# Altium schematic sheet CPU.SchDoc
size A4
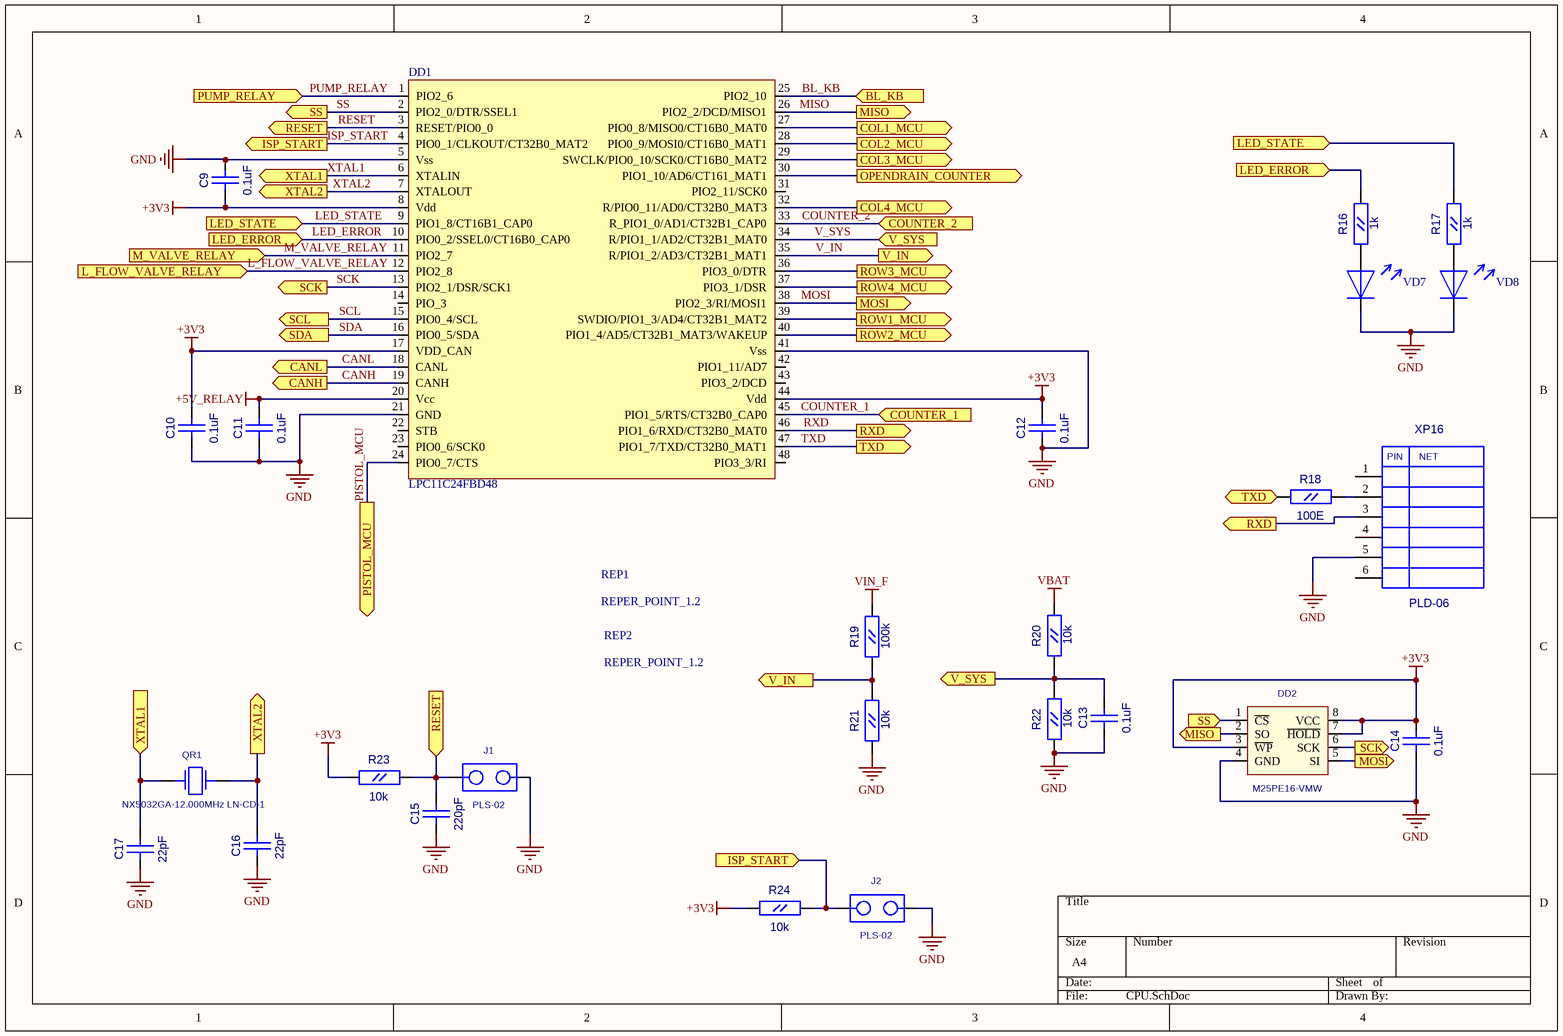
[diagram p0: CPU.SchDoc]

## Parts
C9  0.1uF  [CC0603]
C10  0.1uF  [CC0603]
C11  0.1uF  [CC0603]
C12  0.1uF  [CC0603]
C13  0.1uF  [CC0603]
C14  0.1uF  [CC0603]
C15  220pF  [CC0603]
C16  22pF  [CC0603]
C17  22pF  [CC0603]
DD1  LPC11C24FBD48  [LQFP-48]
DD2  M25PE16-VMW  [EIAJ_SO8]
J1  PLS-02  [PLS-02]
J2  PLS-02  [PLS-02]
QR1  NX5032GA-12.000MHz LN-CD-1  [AC5032_2]
R16  1k  [RC0603]
R17  1k  [RC0603]
R18  100E  [RC0603]
R19  100k  [RC0603]
R20  10k  [RC0603]
R21  10k  [RC0603]
R22  10k  [RC0603]
R23  10k  [RC0603]
R24  10k  [RC0603]
REP1  REPER_POINT_1.2  [REPER1.2]
REP2  REPER_POINT_1.2  [REPER1.2]
VD7  LED_0805  [LED0805]  (value not drawn)
VD8  LED_0805  [LED0805]  (value not drawn)
XP16  PLD-06  [PIN6]

## Ports
BL_KB (in), CANH (out), CANL (out), COL1_MCU (out), COL2_MCU (out), COL3_MCU (out), COL4_MCU (out), COUNTER_1 (in), COUNTER_2 (in), ISP_START (in), ISP_START (out), L_FLOW_VALVE_RELAY (in), LED_ERROR (in), LED_STATE (in), M_VALVE_RELAY (in), MISO, MISO (out), MOSI, MOSI (out), OPENDRAIN_COUNTER (out), PISTOL_MCU (out), PUMP_RELAY (in), RESET (in), RESET (out), ROW1_MCU (out), ROW2_MCU (out), ROW3_MCU (out), ROW4_MCU (out), RXD (out), SCK, SCK (out), SCL (out), SDA (out), SS (in), SS (out), TXD (in), TXD (out), V_IN (out), V_SYS (in), V_SYS (out), XTAL1 (in), XTAL1 (out), XTAL2 (out)

## Nets
+3V3: C9.1(A) C10.2(B) C12.2(B) C14.2(B) DD1.8(Vdd) DD1.17(VDD_CAN) DD1.44(Vdd) DD2.3(~{WP}) DD2.7(~{HOLD}) DD2.8(VCC) R23.1(A) R24.1(A)
+5V_RELAY: C11.2(B) DD1.20(Vcc)
GND: C9.2(B) C10.1(A) C11.1(A) C12.1(A) C13.1(A) C14.1(A) C15.1(A) C16.1(A) C17.1(A) DD1.5(Vss) DD1.21(GND) DD1.41(Vss) DD2.4(GND) J1.2 J2.2 R21.1(A) R22.1(A) VD7.2 VD8.2 XP16.5
VBAT: R20.2(B)
VIN_F: R19.2(B)
BL_KB: DD1.25(PIO2_10) ; port BL_KB
CANH: DD1.19(CANH) ; port CANH
CANL: DD1.18(CANL) ; port CANL
COL1_MCU: DD1.27(PIO0_8/MISO0/CT16B0_MAT0) ; port COL1_MCU
COL2_MCU: DD1.28(PIO0_9/MOSI0/CT16B0_MAT1) ; port COL2_MCU
COL3_MCU: DD1.29(SWCLK/PIO0_10/SCK0/CT16B0_MAT2) ; port COL3_MCU
COL4_MCU: DD1.32(R/PIO0_11/AD0/CT32B0_MAT3) ; port COL4_MCU
COUNTER_1: DD1.45(PIO1_5/RTS/CT32B0_CAP0) ; port COUNTER_1
COUNTER_2: DD1.33(R_PIO1_0/AD1/CT32B1_CAP0) ; port COUNTER_2
ISP_START: DD1.4(PIO0_1/CLKOUT/CT32B0_MAT2) J2.1 R24.2(B) ; port ISP_START
L_FLOW_VALVE_RELAY: DD1.12(PIO2_8) ; port L_FLOW_VALVE_RELAY
LED_ERROR: DD1.10(PIO0_2/SSEL0/CT16B0_CAP0) R16.2(B) ; port LED_ERROR
LED_STATE: DD1.9(PIO1_8/CT16B1_CAP0) R17.2(B) ; port LED_STATE
M_VALVE_RELAY: DD1.11(PIO2_7) ; port M_VALVE_RELAY
MISO: DD1.26(PIO2_2/DCD/MISO1) DD2.2(SO) ; port MISO
MOSI: DD1.38(PIO2_3/RI/MOSI1) DD2.5(SI) ; port MOSI
OPENDRAIN_COUNTER: DD1.30(PIO1_10/AD6/CT161_MAT1) ; port OPENDRAIN_COUNTER
PISTOL_MCU: DD1.24(PIO0_7/CTS) ; port PISTOL_MCU
PUMP_RELAY: DD1.1(PIO2_6) ; port PUMP_RELAY
RESET: C15.2(B) DD1.3(RESET/PIO0_0) J1.1 R23.2(B) ; port RESET
ROW1_MCU: DD1.39(SWDIO/PIO1_3/AD4/CT32B1_MAT2) ; port ROW1_MCU
ROW2_MCU: DD1.40(PIO1_4/AD5/CT32B1_MAT3/WAKEUP) ; port ROW2_MCU
ROW3_MCU: DD1.36(PIO3_0/DTR) ; port ROW3_MCU
ROW4_MCU: DD1.37(PIO3_1/DSR) ; port ROW4_MCU
RXD: DD1.46(PIO1_6/RXD/CT32B0_MAT0) XP16.3 ; port RXD
SCK: DD1.13(PIO2_1/DSR/SCK1) DD2.6(SCK) ; port SCK
SCL: DD1.15(PIO0_4/SCL) ; port SCL
SDA: DD1.16(PIO0_5/SDA) ; port SDA
SS: DD1.2(PIO2_0/DTR/SSEL1) DD2.1(~{CS}) ; port SS
TXD: DD1.47(PIO1_7/TXD/CT32B0_MAT1) R18.1(A) ; port TXD
V_IN: DD1.35(R/PIO1_2/AD3/CT32B1_MAT1) R19.1(A) R21.2(B) ; port V_IN
V_SYS: C13.2(B) DD1.34(R/PIO1_1/AD2/CT32B1_MAT0) R20.1(A) R22.2(B) ; port V_SYS
XTAL1: C17.2(B) DD1.6(XTALIN) QR1.1 ; port XTAL1
XTAL2: C16.2(B) DD1.7(XTALOUT) QR1.2 ; port XTAL2
NetR16_1: R16.1(A) VD7.1
NetR17_1: R17.1(A) VD8.1
NetR18_2: R18.2(B) XP16.2

Not connected (* = marked no-connect by the designer): DD1 14(PIO_3) 22(STB) 23(PIO0_6/SCK0) 31(PIO2_11/SCK0) 42(PIO1_11/AD7) 43(PIO3_2/DCD) 48(PIO3_3/RI); REP1 1; REP2 1; XP16 1 4 6

## Notes on the sheet
- (in symbol PLD-06) PIN; NET

## Library data of the parts
C9-C17 = CC0603
  C9-C14: Value: 0.1uF
  C15: Value: 220pF
  C16 C17: Value: 22pF
DD2 = S25FL016A0LMFI01: Value: M25PE16-VMW
QR1 = AC5032_2: AC5032/2; Value: NX5032GA-12.000MHz LN-CD-1
R16-R24 = RC0603
  R16 R17: Value: 1k
  R18: Value: 100E
  R19: Value: 100k
  R20-R24: Value: 10k
REP1 REP2 = REPER1.2: Value: REPER_POINT_1.2
XP16 = PLD-06: PLD06; Value: *
DD1 = LPC11C24FBD48: Value: LPC11C24FBD48
J1 J2 = PLS-02: Value: *
VD7 VD8 = LED_0805: Value: LED_0805